# EAGLE schematic lpcdev (EAGLE 7.5.0)
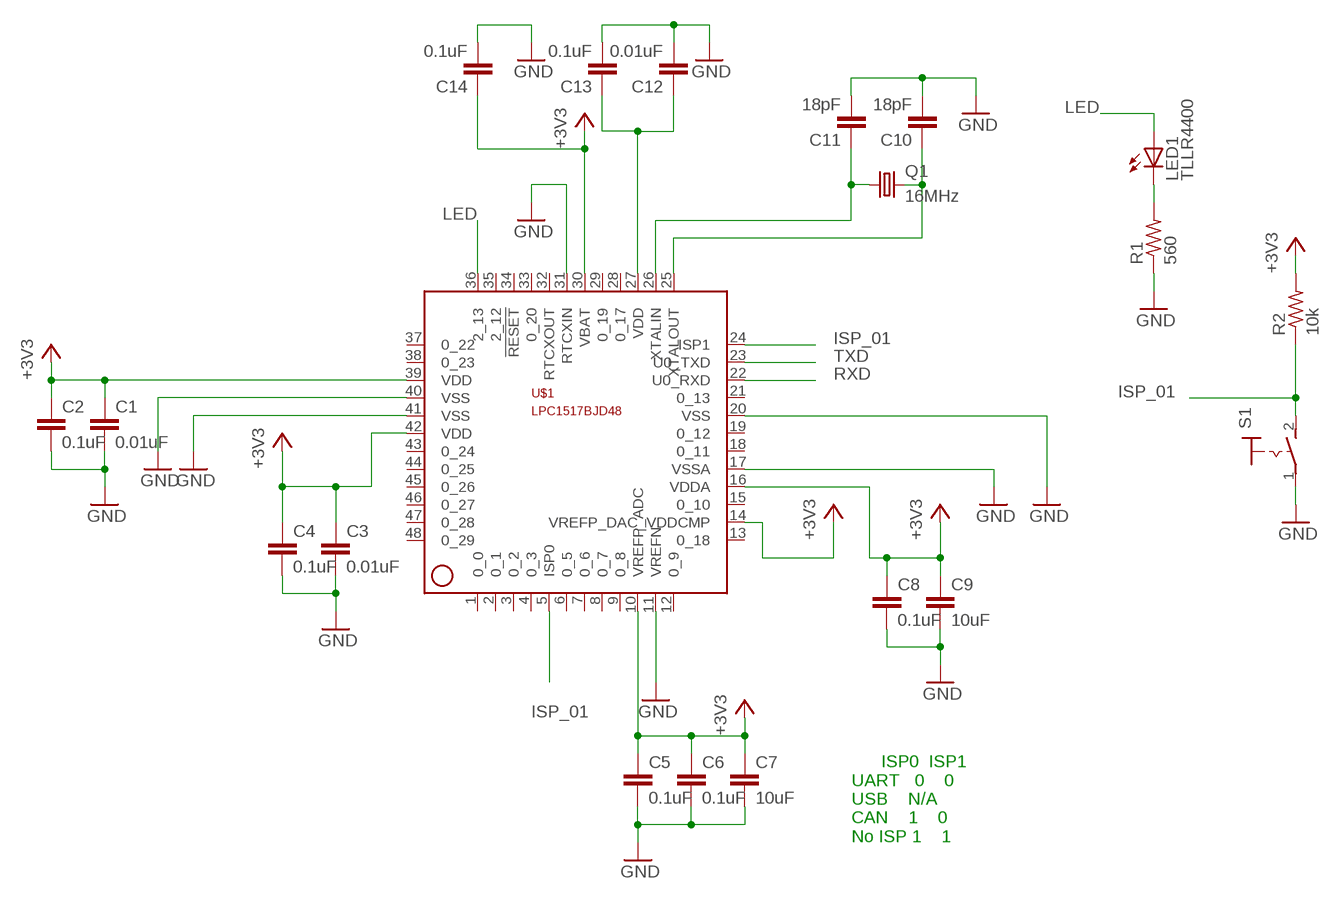
[diagram p0: schematic, sheet 1]

## Parts
C1  0.01uF  C-EUC0805  [C0805]
C2  0.1uF  C-EUC0805  [C0805]
C3  0.01uF  C-EUC0805  [C0805]
C4  0.1uF  C-EUC0805  [C0805]
C5  0.1uF  C-EUC0805  [C0805]
C6  0.1uF  C-EUC0805  [C0805]
C7  10uF  C-EUC0805  [C0805]
C8  0.1uF  C-EUC0805  [C0805]
C9  10uF  C-EUC0805  [C0805]
C10  18pF  C-EUC0805  [C0805]
C11  18pF  C-EUC0805  [C0805]
C12  0.01uF  C-EUC0805  [C0805]
C13  0.1uF  C-EUC0805  [C0805]
C14  0.1uF  C-EUC0805  [C0805]
LED1  TLLR4400  [LED3MM]
Q1  16MHz  CRYSTALCTS406  [CTS406]
R1  560  R-US_0207/7  [0207/7]
R2  10k  R-US_0207/7  [0207/7]
S1  MS243  [MS243]
U$1  LPC1517BJD48  [LQFP48]

## Nets
+3V3: C1.1 C2.1 C3.1 C4.1 C5.1 C6.1 C7.1 C8.1 C9.1 C14.1 R2.2 U$1.10(VREFP_ADC) U$1.14(VREFP_DAC_VDDCMP) U$1.16(VDDA) U$1.30(VBAT) U$1.39(VDD) U$1.42(VDD)
GND: C1.2 C2.2 C3.2 C4.2 C5.2 C6.2 C7.2 C8.2 C9.2 C10.2 C11.2 C12.2 C13.2 C14.2 R1.1 S1.1(P) U$1.11(VREFN) U$1.17(VSSA) U$1.20(VSS) U$1.31(RTCXIN) U$1.40(VSS) U$1.41(VSS)
ISP_01: R2.1 S1.2(S) U$1.5(ISP0) U$1.24(ISP1)
LED: LED1.A U$1.36(2_13)
N$1: LED1.K(C) R1.2
N$15: C10.1 Q1.3 U$1.25(XTALOUT)
N$16: C11.1 Q1.1 U$1.26(XTALIN)
N$17: C12.1 C13.1 U$1.27(VDD)
RXD: U$1.22(U0_RXD)
TXD: U$1.23(U0_TXD)
Unconnected: U$1.1(0_0) U$1.2(0_1) U$1.3(0_2) U$1.4(0_3) U$1.6(0_5) U$1.7(0_6) U$1.8(0_7) U$1.9(0_8) U$1.12(0_9) U$1.13(0_18) U$1.15(0_10) U$1.18(0_11) U$1.19(0_12) U$1.21(0_13) U$1.28(0_17) U$1.29(0_19) U$1.32(RTCXOUT) U$1.33(0_20) U$1.34(!RESET) U$1.35(2_12) U$1.37(0_22) U$1.38(0_23) U$1.43(0_24) U$1.44(0_25) U$1.45(0_26) U$1.46(0_27) U$1.47(0_28) U$1.48(0_29)

## Notes on the sheet
- ISP0  ISP1
  UART   0    0
  USB    N/A
  CAN    1    0
  No ISP 1    1

## Library data of the parts
C1-C14 = rcl:C-EU: CAPACITOR, European symbol
LED1 = led:TLLR4400: Low Current (2mA) LED 3 mm Tinted Diffused Package color RED Source: Data sheet <http://www.farnell.com/datasheets/391100.pdf>; MF: VISHAY SEMICONDUCTOR; OC_FARNELL: 1612437
Q1 = crystal:CRYSTAL: CRYSTAL; OC_FARNELL: unknown; OC_NEWARK: unknown
R1 R2 = rcl:R-US_: RESISTOR, American symbol
S1 = switch:MS243: TOGGLE SWITCH
U$1 = lpclib:LPC1517BJD48: LPC1517BJD48 First try at a LPC1517 chip for use in a motor driver Datasheet <http://www.nxp.com/documents/data_sheet/LPC15XX.pdf> User manual <http://www.nxp.com/documents/user_manual/UM10736.pdf>